# Altium schematic sheet Stm32_Block.SchDoc
size A3; SheetNumber: 1; SheetTotal: 7
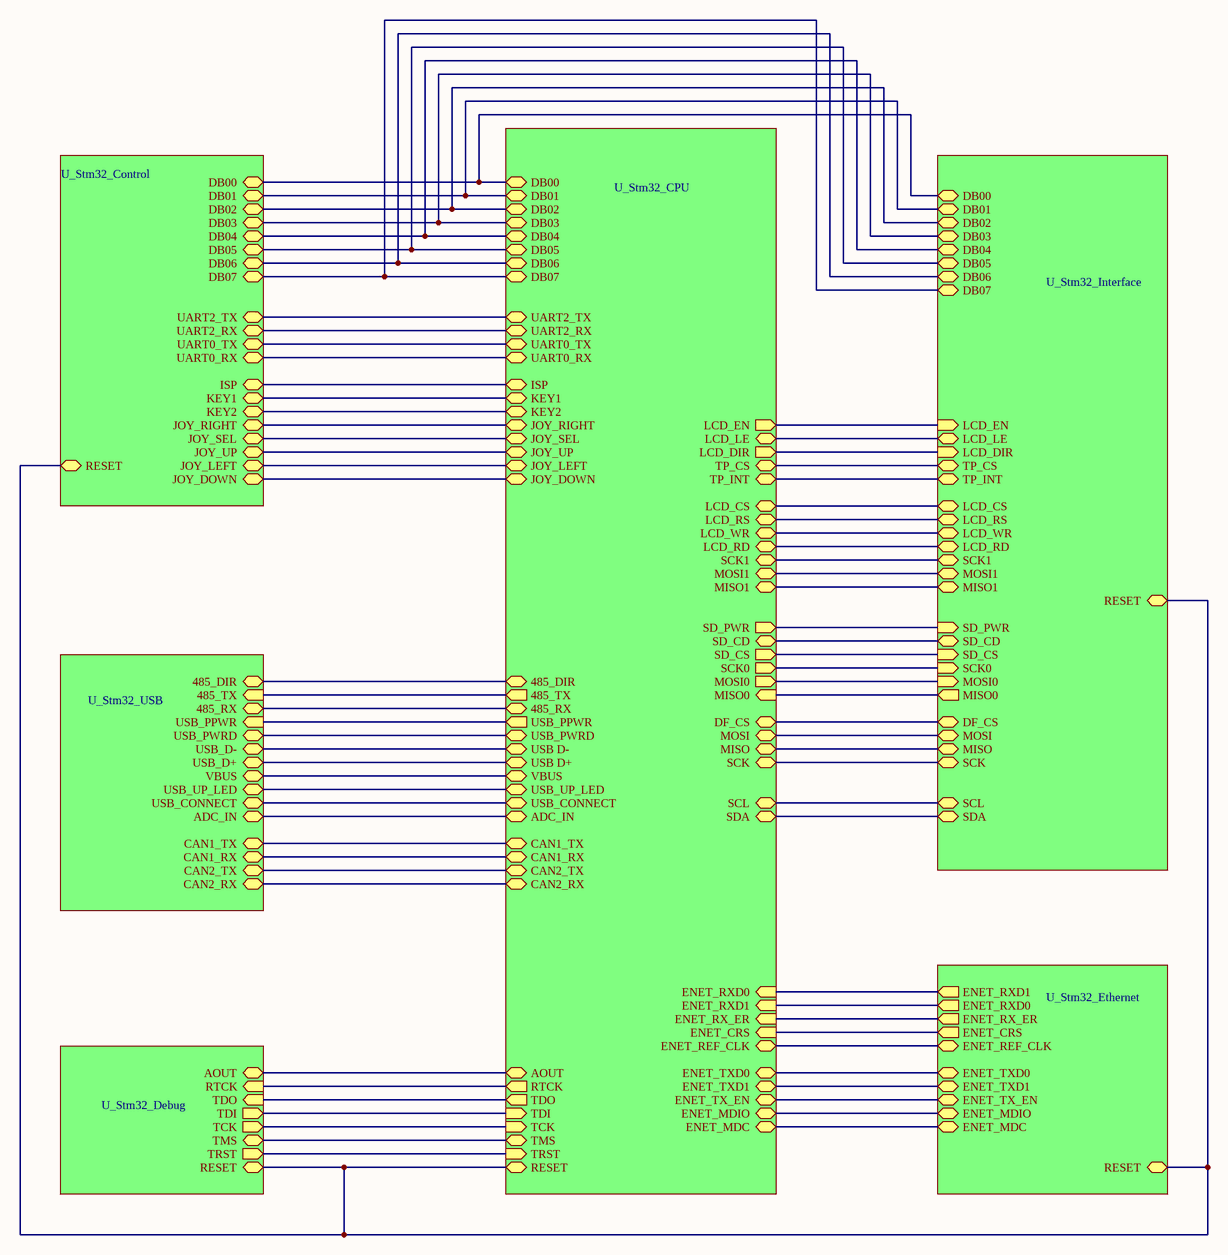
[diagram p0: Stm32_Block.SchDoc]

## Sub-sheets
U_Stm32_Control = Stm32_Control.SchDoc: UART2_TX (bidir), UART2_RX (bidir), UART0_RX (bidir), UART0_TX (bidir), ISP (bidir), RESET (bidir), DB00 (bidir), DB01 (bidir), DB02 (bidir), DB03 (bidir), DB04 (bidir), DB05 (bidir), DB06 (bidir), DB07 (bidir), KEY1 (bidir), KEY2 (bidir), JOY_RIGHT (bidir), JOY_SEL (bidir), JOY_UP (bidir), JOY_LEFT (bidir), JOY_DOWN (bidir)
U_Stm32_CPU = Stm32_CPU.SchDoc: CAN1_RX (bidir), CAN1_TX (bidir), UART0_TX (bidir), UART0_RX (bidir), CAN2_RX (bidir), CAN2_TX (bidir), SCK1 (bidir), MISO1 (bidir), MOSI1 (bidir), UART2_TX (bidir), UART2_RX (bidir), SCK (bidir), DF_CS (bidir), MISO (bidir), MOSI (bidir), LCD_EN (out), LCD_LE (bidir), LCD_DIR (out), LCD_CS (bidir), LCD_RS (bidir), LCD_WR (bidir), LCD_RD (bidir), AOUT (bidir), SDA (bidir), SCL (bidir), USB D+ (bidir), USB D- (bidir), ENET_CRS (in), ENET_TXD0 (bidir), ENET_TXD1 (bidir), ENET_TX_EN (bidir), ENET_RXD0 (in), ENET_RXD1 (in), ENET_RX_ER (in), ENET_REF_CLK (bidir), ENET_MDC (bidir), ENET_MDIO (bidir), USB_UP_LED (bidir), USB_PPWR (out), SCK0 (out), SD_CS (out), USB_PWRD (bidir), MISO0 (in), MOSI0 (out), JOY_SEL (bidir), JOY_DOWN (bidir), JOY_LEFT (bidir), JOY_RIGHT (bidir), JOY_UP (bidir), VBUS (bidir), ADC_IN (bidir), DB00 (bidir), DB01 (bidir), DB02 (bidir), DB03 (bidir), DB04 (bidir), DB05 (bidir), DB06 (bidir), DB07 (bidir), 485_DIR (bidir), USB_CONNECT (bidir), ISP (bidir), KEY1 (bidir), KEY2 (bidir), TP_INT (bidir), SD_CD (bidir), SD_PWR (out), 485_TX (out), 485_RX (bidir), TDI (in), TDO (out), TCK (in), TMS (bidir), TRST (in), RTCK (out), RESET (bidir), TP_CS (bidir)
U_Stm32_Debug = Stm32_Debug.SchDoc: AOUT (bidir), TRST (out), TDI (out), TMS (bidir), TCK (out), RTCK (in), TDO (in), RESET (bidir)
U_Stm32_Ethernet = Stm32_Ethernet.SchDoc: ENET_REF_CLK (bidir), RESET (bidir), ENET_TXD0 (bidir), ENET_TXD1 (bidir), ENET_TX_EN (bidir), ENET_CRS (out), ENET_RX_ER (out), ENET_RXD0 (out), ENET_RXD1 (out), ENET_MDIO (bidir), ENET_MDC (bidir)
U_Stm32_Interface = Stm32_Interface.SchDoc: LCD_RD (bidir), LCD_WR (bidir), MOSI1 (bidir), SCK1 (bidir), MISO1 (bidir), TP_CS (bidir), LCD_RS (bidir), LCD_CS (bidir), TP_INT (bidir), SCL (bidir), SDA (bidir), DF_CS (bidir), RESET (bidir), SCK (bidir), MOSI (bidir), MISO (bidir), SD_CD (bidir), MOSI0 (in), SCK0 (in), MISO0 (out), SD_CS (in), SD_PWR (in), LCD_DIR (in), LCD_LE (bidir), LCD_EN (in), DB00 (bidir), DB01 (bidir), DB02 (bidir), DB03 (bidir), DB04 (bidir), DB05 (bidir), DB06 (bidir), DB07 (bidir)
U_Stm32_USB = Stm32_USB.SchDoc: USB_PPWR (in), USB_PWRD (bidir), USB_D- (bidir), USB_D+ (bidir), VBUS (bidir), USB_UP_LED (bidir), USB_CONNECT (bidir), ADC_IN (bidir), 485_DIR (bidir), 485_RX (bidir), 485_TX (in), CAN1_TX (bidir), CAN1_RX (bidir), CAN2_TX (bidir), CAN2_RX (bidir)

## Nets
(unnamed): sheet U_Stm32_CPU/CAN1_RX, sheet U_Stm32_USB/CAN1_RX
(unnamed): sheet U_Stm32_CPU/CAN1_TX, sheet U_Stm32_USB/CAN1_TX
(unnamed): sheet U_Stm32_CPU/UART0_TX, sheet U_Stm32_Control/UART0_TX
(unnamed): sheet U_Stm32_CPU/UART0_RX, sheet U_Stm32_Control/UART0_RX
(unnamed): sheet U_Stm32_CPU/CAN2_RX, sheet U_Stm32_USB/CAN2_RX
(unnamed): sheet U_Stm32_CPU/CAN2_TX, sheet U_Stm32_USB/CAN2_TX
(unnamed): sheet U_Stm32_CPU/SCK1, sheet U_Stm32_Interface/SCK1
(unnamed): sheet U_Stm32_CPU/MISO1, sheet U_Stm32_Interface/MISO1
(unnamed): sheet U_Stm32_CPU/MOSI1, sheet U_Stm32_Interface/MOSI1
(unnamed): sheet U_Stm32_CPU/UART2_TX, sheet U_Stm32_Control/UART2_TX
(unnamed): sheet U_Stm32_CPU/UART2_RX, sheet U_Stm32_Control/UART2_RX
(unnamed): sheet U_Stm32_CPU/SCK, sheet U_Stm32_Interface/SCK
(unnamed): sheet U_Stm32_CPU/DF_CS, sheet U_Stm32_Interface/DF_CS
(unnamed): sheet U_Stm32_CPU/MISO, sheet U_Stm32_Interface/MISO
(unnamed): sheet U_Stm32_CPU/MOSI, sheet U_Stm32_Interface/MOSI
(unnamed): sheet U_Stm32_CPU/LCD_EN, sheet U_Stm32_Interface/LCD_EN
(unnamed): sheet U_Stm32_CPU/LCD_LE, sheet U_Stm32_Interface/LCD_LE
(unnamed): sheet U_Stm32_CPU/LCD_DIR, sheet U_Stm32_Interface/LCD_DIR
(unnamed): sheet U_Stm32_CPU/LCD_CS, sheet U_Stm32_Interface/LCD_CS
(unnamed): sheet U_Stm32_CPU/LCD_RS, sheet U_Stm32_Interface/LCD_RS
(unnamed): sheet U_Stm32_CPU/LCD_WR, sheet U_Stm32_Interface/LCD_WR
(unnamed): sheet U_Stm32_CPU/LCD_RD, sheet U_Stm32_Interface/LCD_RD
(unnamed): sheet U_Stm32_CPU/AOUT, sheet U_Stm32_Debug/AOUT
(unnamed): sheet U_Stm32_CPU/SDA, sheet U_Stm32_Interface/SDA
(unnamed): sheet U_Stm32_CPU/SCL, sheet U_Stm32_Interface/SCL
(unnamed): sheet U_Stm32_CPU/USB D+, sheet U_Stm32_USB/USB_D+
(unnamed): sheet U_Stm32_CPU/USB D-, sheet U_Stm32_USB/USB_D-
(unnamed): sheet U_Stm32_CPU/ENET_CRS, sheet U_Stm32_Ethernet/ENET_CRS
(unnamed): sheet U_Stm32_CPU/ENET_TXD0, sheet U_Stm32_Ethernet/ENET_TXD0
(unnamed): sheet U_Stm32_CPU/ENET_TXD1, sheet U_Stm32_Ethernet/ENET_TXD1
(unnamed): sheet U_Stm32_CPU/ENET_TX_EN, sheet U_Stm32_Ethernet/ENET_TX_EN
(unnamed): sheet U_Stm32_CPU/ENET_RXD0, sheet U_Stm32_Ethernet/ENET_RXD1
(unnamed): sheet U_Stm32_CPU/ENET_RXD1, sheet U_Stm32_Ethernet/ENET_RXD0
(unnamed): sheet U_Stm32_CPU/ENET_RX_ER, sheet U_Stm32_Ethernet/ENET_RX_ER
(unnamed): sheet U_Stm32_CPU/ENET_REF_CLK, sheet U_Stm32_Ethernet/ENET_REF_CLK
(unnamed): sheet U_Stm32_CPU/ENET_MDC, sheet U_Stm32_Ethernet/ENET_MDC
(unnamed): sheet U_Stm32_CPU/ENET_MDIO, sheet U_Stm32_Ethernet/ENET_MDIO
(unnamed): sheet U_Stm32_CPU/USB_UP_LED, sheet U_Stm32_USB/USB_UP_LED
(unnamed): sheet U_Stm32_CPU/USB_PPWR, sheet U_Stm32_USB/USB_PPWR
(unnamed): sheet U_Stm32_CPU/SCK0, sheet U_Stm32_Interface/SCK0
(unnamed): sheet U_Stm32_CPU/SD_CS, sheet U_Stm32_Interface/SD_CS
(unnamed): sheet U_Stm32_CPU/USB_PWRD, sheet U_Stm32_USB/USB_PWRD
(unnamed): sheet U_Stm32_CPU/MISO0, sheet U_Stm32_Interface/MISO0
(unnamed): sheet U_Stm32_CPU/MOSI0, sheet U_Stm32_Interface/MOSI0
(unnamed): sheet U_Stm32_CPU/JOY_SEL, sheet U_Stm32_Control/JOY_SEL
(unnamed): sheet U_Stm32_CPU/JOY_DOWN, sheet U_Stm32_Control/JOY_DOWN
(unnamed): sheet U_Stm32_CPU/JOY_LEFT, sheet U_Stm32_Control/JOY_LEFT
(unnamed): sheet U_Stm32_CPU/JOY_RIGHT, sheet U_Stm32_Control/JOY_RIGHT
(unnamed): sheet U_Stm32_CPU/JOY_UP, sheet U_Stm32_Control/JOY_UP
(unnamed): sheet U_Stm32_CPU/VBUS, sheet U_Stm32_USB/VBUS
(unnamed): sheet U_Stm32_CPU/ADC_IN, sheet U_Stm32_USB/ADC_IN
(unnamed): sheet U_Stm32_CPU/DB00, sheet U_Stm32_Interface/DB00, sheet U_Stm32_Control/DB00
(unnamed): sheet U_Stm32_CPU/DB01, sheet U_Stm32_Interface/DB01, sheet U_Stm32_Control/DB01
(unnamed): sheet U_Stm32_CPU/DB02, sheet U_Stm32_Interface/DB02, sheet U_Stm32_Control/DB02
(unnamed): sheet U_Stm32_CPU/DB03, sheet U_Stm32_Interface/DB03, sheet U_Stm32_Control/DB03
(unnamed): sheet U_Stm32_CPU/DB04, sheet U_Stm32_Interface/DB04, sheet U_Stm32_Control/DB04
(unnamed): sheet U_Stm32_CPU/DB05, sheet U_Stm32_Interface/DB05, sheet U_Stm32_Control/DB05
(unnamed): sheet U_Stm32_CPU/DB06, sheet U_Stm32_Interface/DB06, sheet U_Stm32_Control/DB06
(unnamed): sheet U_Stm32_CPU/DB07, sheet U_Stm32_Interface/DB07, sheet U_Stm32_Control/DB07
(unnamed): sheet U_Stm32_CPU/485_DIR, sheet U_Stm32_USB/485_DIR
(unnamed): sheet U_Stm32_CPU/USB_CONNECT, sheet U_Stm32_USB/USB_CONNECT
(unnamed): sheet U_Stm32_CPU/ISP, sheet U_Stm32_Control/ISP
(unnamed): sheet U_Stm32_CPU/KEY1, sheet U_Stm32_Control/KEY1
(unnamed): sheet U_Stm32_CPU/KEY2, sheet U_Stm32_Control/KEY2
(unnamed): sheet U_Stm32_CPU/TP_INT, sheet U_Stm32_Interface/TP_INT
(unnamed): sheet U_Stm32_CPU/SD_CD, sheet U_Stm32_Interface/SD_CD
(unnamed): sheet U_Stm32_CPU/SD_PWR, sheet U_Stm32_Interface/SD_PWR
(unnamed): sheet U_Stm32_CPU/485_TX, sheet U_Stm32_USB/485_TX
(unnamed): sheet U_Stm32_CPU/485_RX, sheet U_Stm32_USB/485_RX
(unnamed): sheet U_Stm32_CPU/TDI, sheet U_Stm32_Debug/TDI
(unnamed): sheet U_Stm32_CPU/TDO, sheet U_Stm32_Debug/TDO
(unnamed): sheet U_Stm32_CPU/TCK, sheet U_Stm32_Debug/TCK
(unnamed): sheet U_Stm32_CPU/TMS, sheet U_Stm32_Debug/TMS
(unnamed): sheet U_Stm32_CPU/TRST, sheet U_Stm32_Debug/TRST
(unnamed): sheet U_Stm32_CPU/RTCK, sheet U_Stm32_Debug/RTCK
(unnamed): sheet U_Stm32_CPU/RESET, sheet U_Stm32_Debug/RESET, sheet U_Stm32_Ethernet/RESET, sheet U_Stm32_Interface/RESET, sheet U_Stm32_Control/RESET
(unnamed): sheet U_Stm32_CPU/TP_CS, sheet U_Stm32_Interface/TP_CS